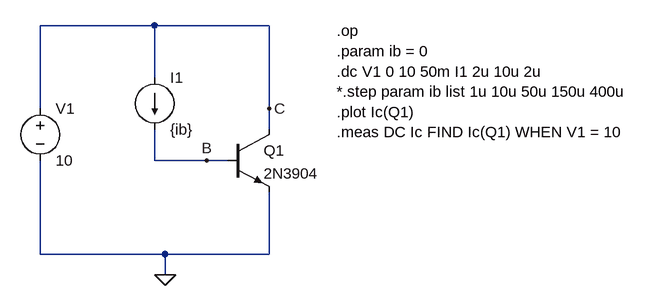
[diagram p0: schematic bjt-vce-sweep.asc]
bjt-vce-sweep.asc, the LTspice schematic file:
Version 4
SHEET 1 1780 680
WIRE 992 -112 816 -112
WIRE 1168 -112 992 -112
WIRE 992 -32 992 -112
WIRE 816 16 816 -112
WIRE 1168 16 1168 -112
WIRE 1168 48 1168 16
WIRE 992 96 992 48
WIRE 1072 96 992 96
WIRE 1104 96 1072 96
WIRE 816 240 816 96
WIRE 1008 240 816 240
WIRE 1168 240 1168 144
WIRE 1168 240 1008 240
WIRE 1008 272 1008 240
FLAG 1008 272 0
FLAG 1072 96 B
FLAG 1168 16 C
SYMBOL npn 1104 48 R0
SYMATTR InstName Q1
SYMATTR Value 2N3904
SYMBOL current 992 -32 R0
SYMATTR InstName I1
SYMATTR Value {ib}
SYMBOL voltage 816 0 R0
SYMATTR InstName V1
SYMATTR Value 10
TEXT 1272 -104 Left 2 !.op\n.param ib = 0\n.dc V1 0 10 50m I1 2u 10u 2u\n*.step param ib list 1u 10u 50u 150u 400u\n.plot Ic(Q1)\n.meas DC Ic FIND Ic(Q1) WHEN V1 = 10

The netlist it stands for:
* bjt-vce-sweep.asc
Q1 C B 0 0 2N3904
I1 C B {ib}
V1 C 0 10
.model NPN NPN
.model PNP PNP
.lib standard.bjt
.op
.param ib = 0
.dc V1 0 10 50m I1 2u 10u 2u
*.step param ib list 1u 10u 50u 150u 400u
.plot Ic(Q1)
.meas DC Ic FIND Ic(Q1) WHEN V1 = 10
.backanno
.end